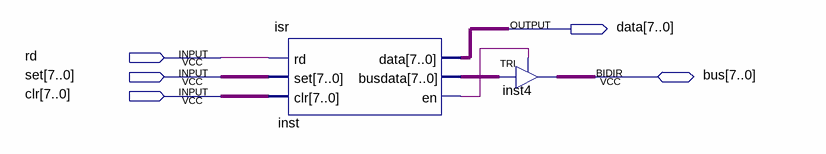
[diagram p0: schematic sheet]
// Quartus schematic isr_a.bdf as structural Verilog: 2 symbols, 5 pins
module isr_a (
  input  rd,
  input  [7:0] set,
  input  [7:0] clr,
  inout  [7:0] bus,
  output [7:0] data
);

  wire inst_en;
  wire [7:0] inst_busdata;

  isr inst (.rd(rd), .set(set), .clr(clr), .data(data), .busdata(inst_busdata), .en(inst_en));
  TRI inst4[7:0] (.IN(inst_busdata), .OE(inst_en), .OUT(bus));
endmodule
